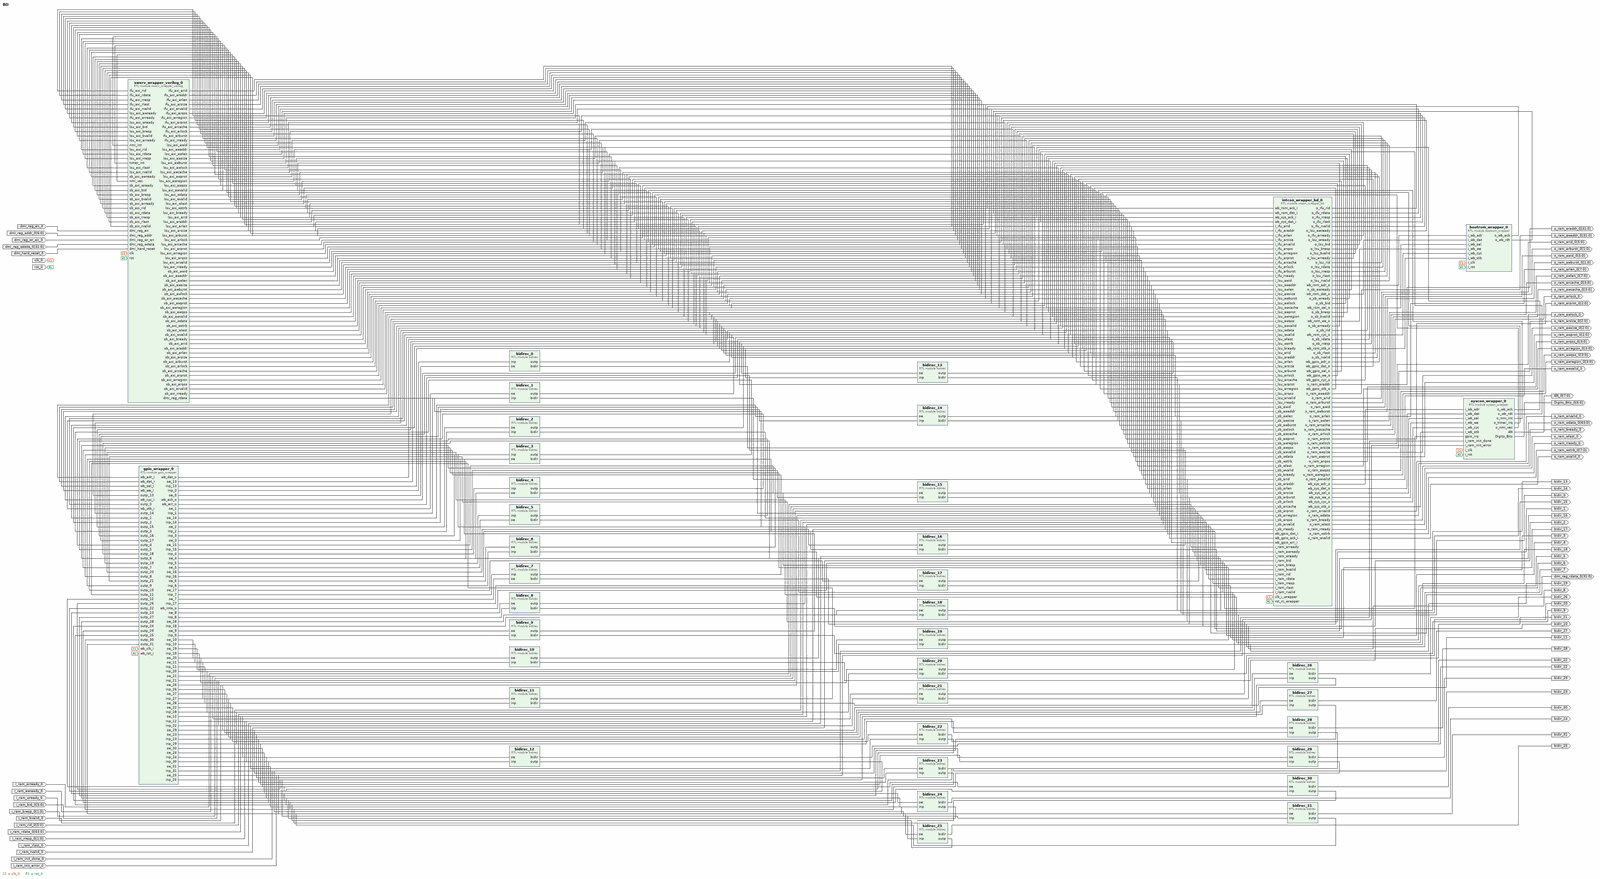
[diagram p0: block diagram of the top level, whole]
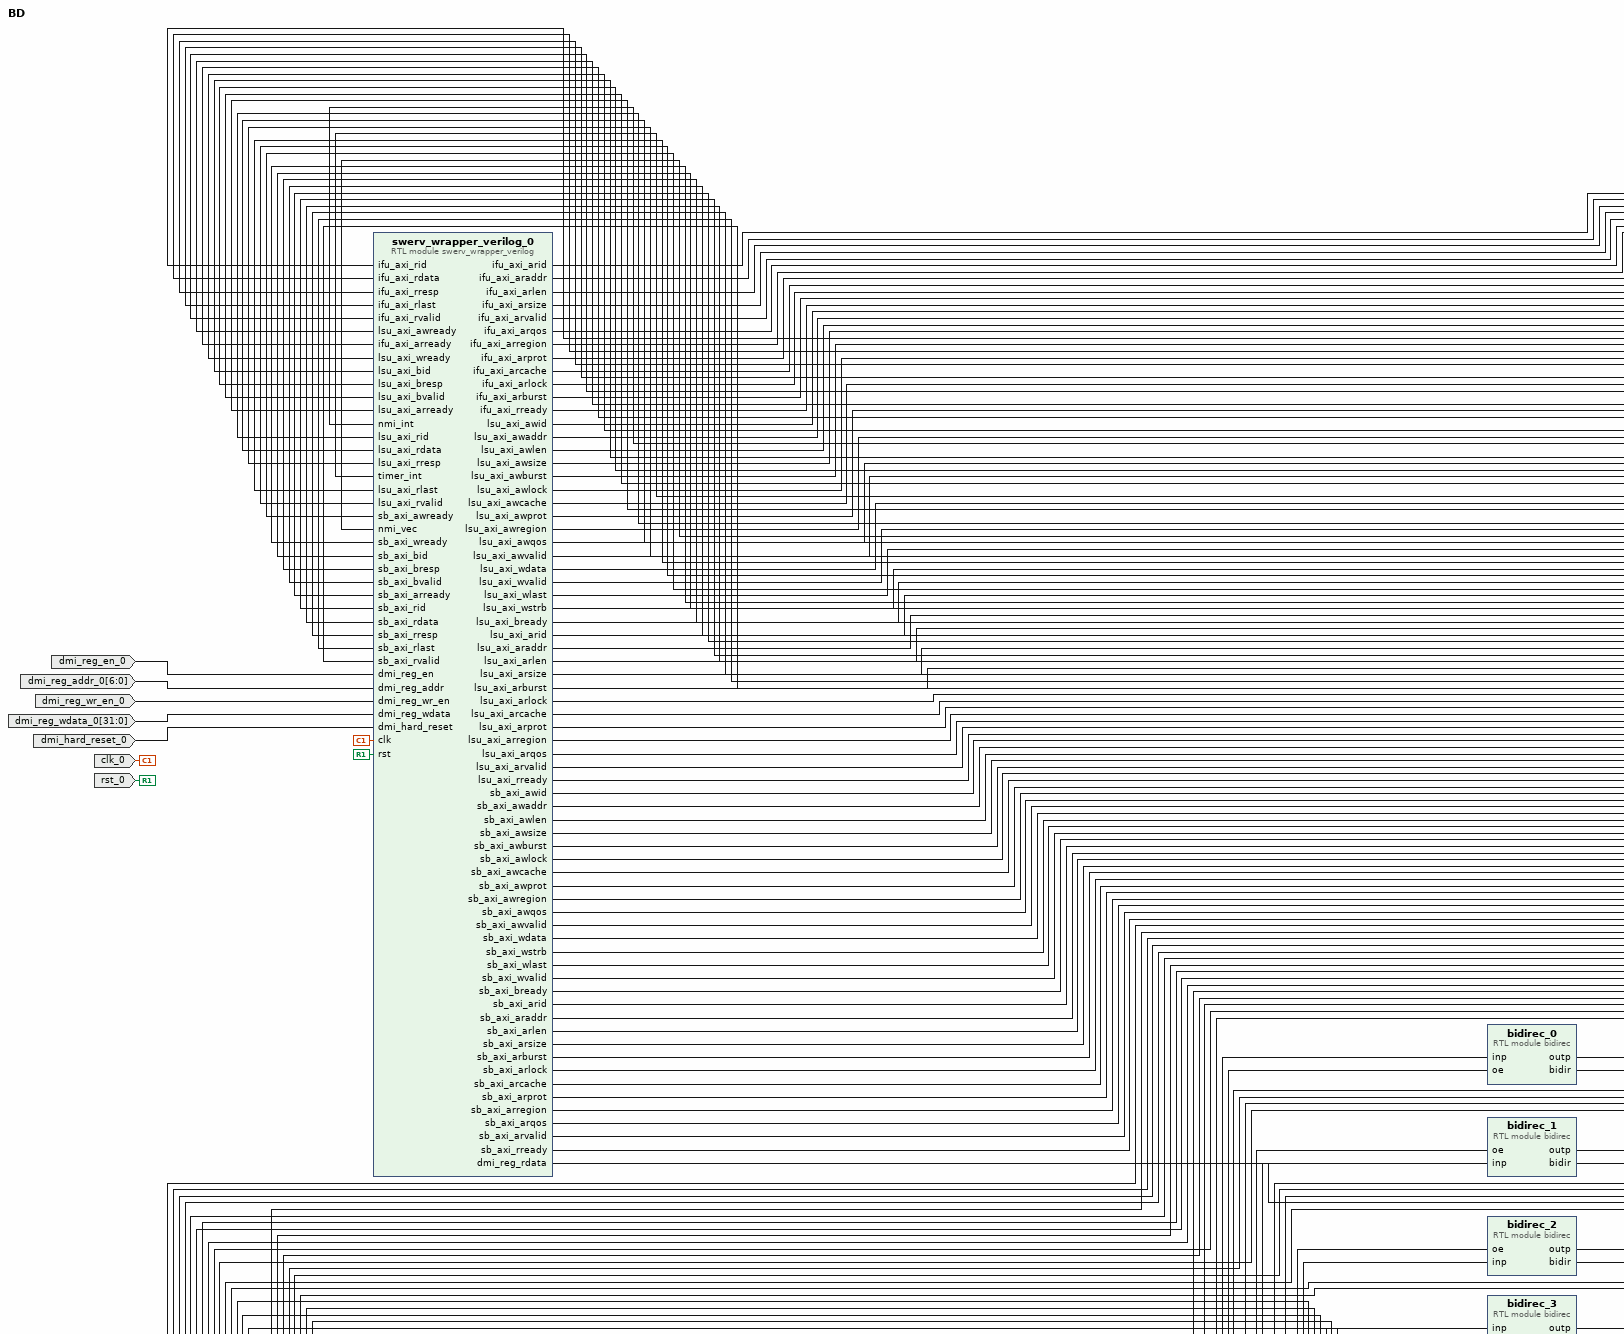
[diagram p1: block diagram of the top level, upper left part]
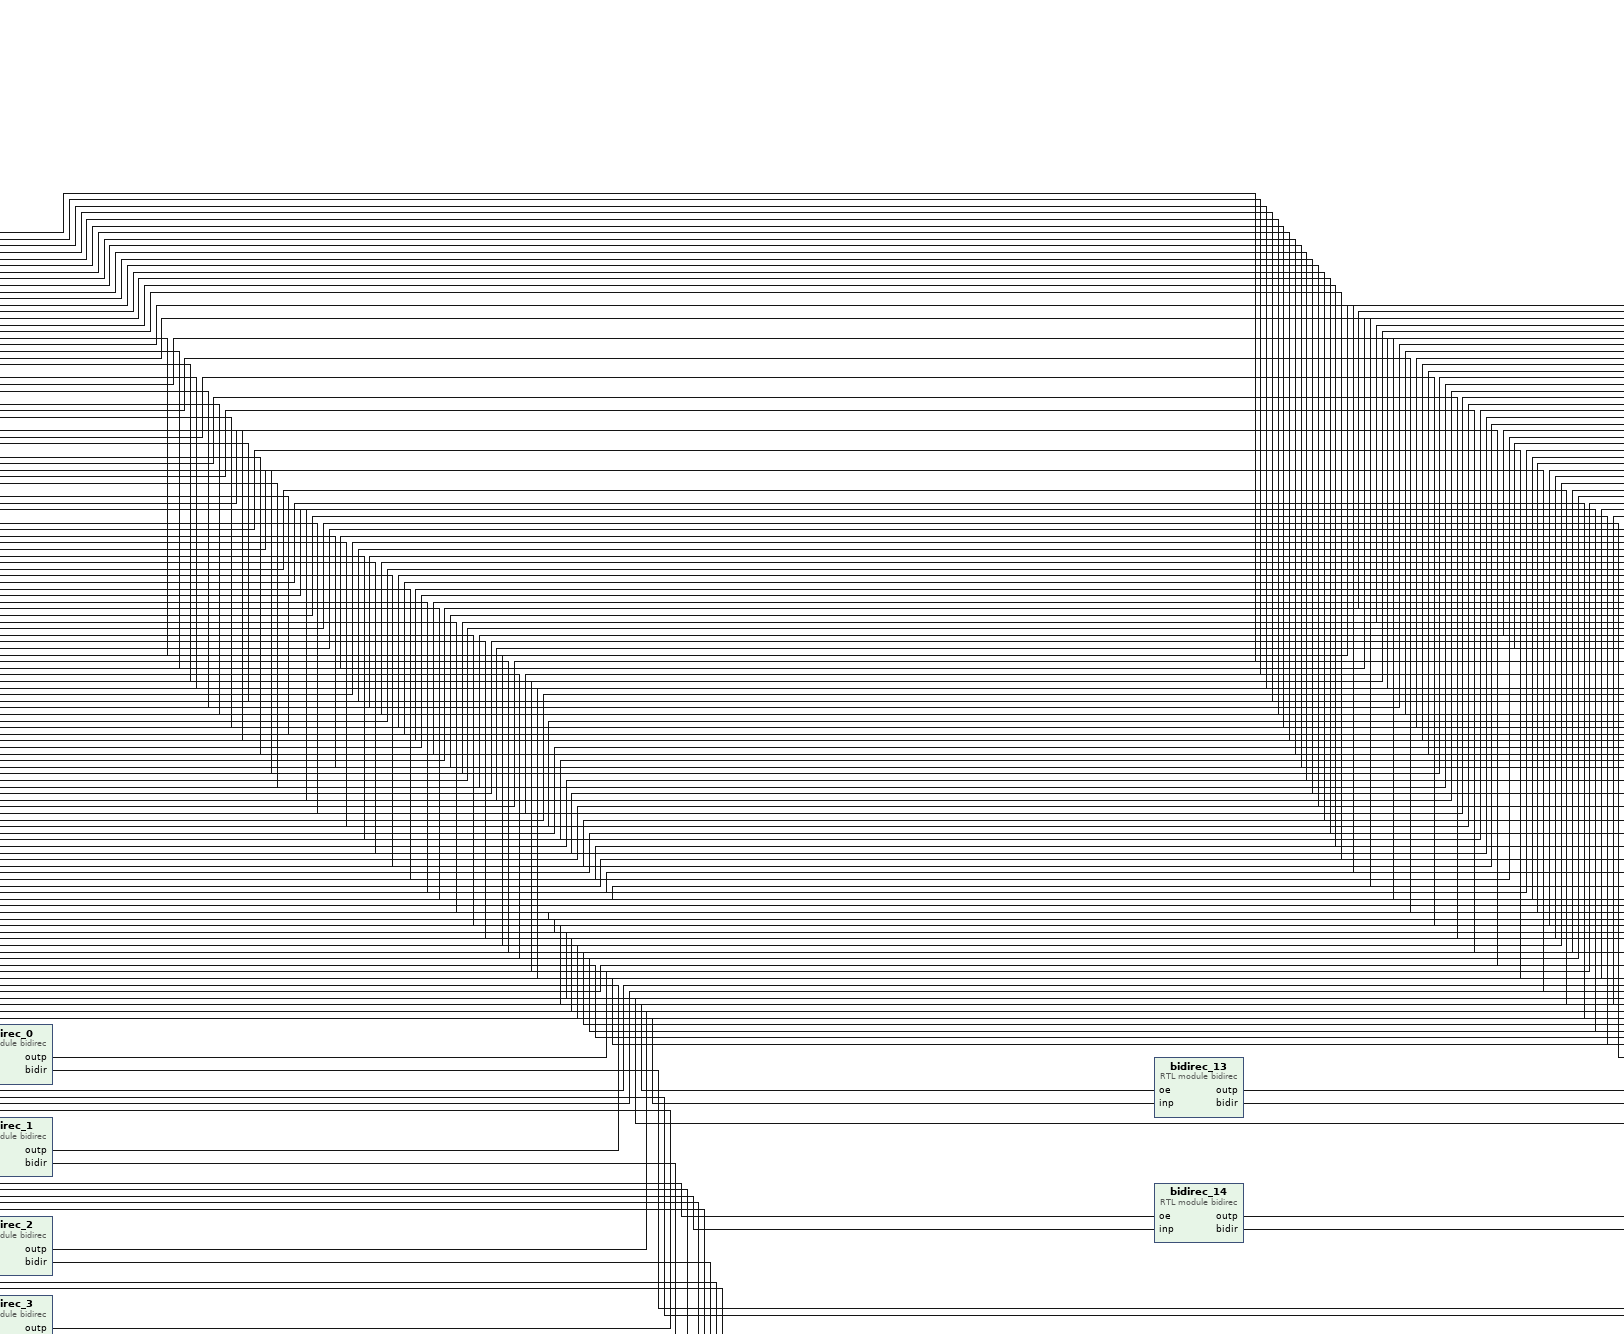
[diagram p2: block diagram of the top level, upper centre part]
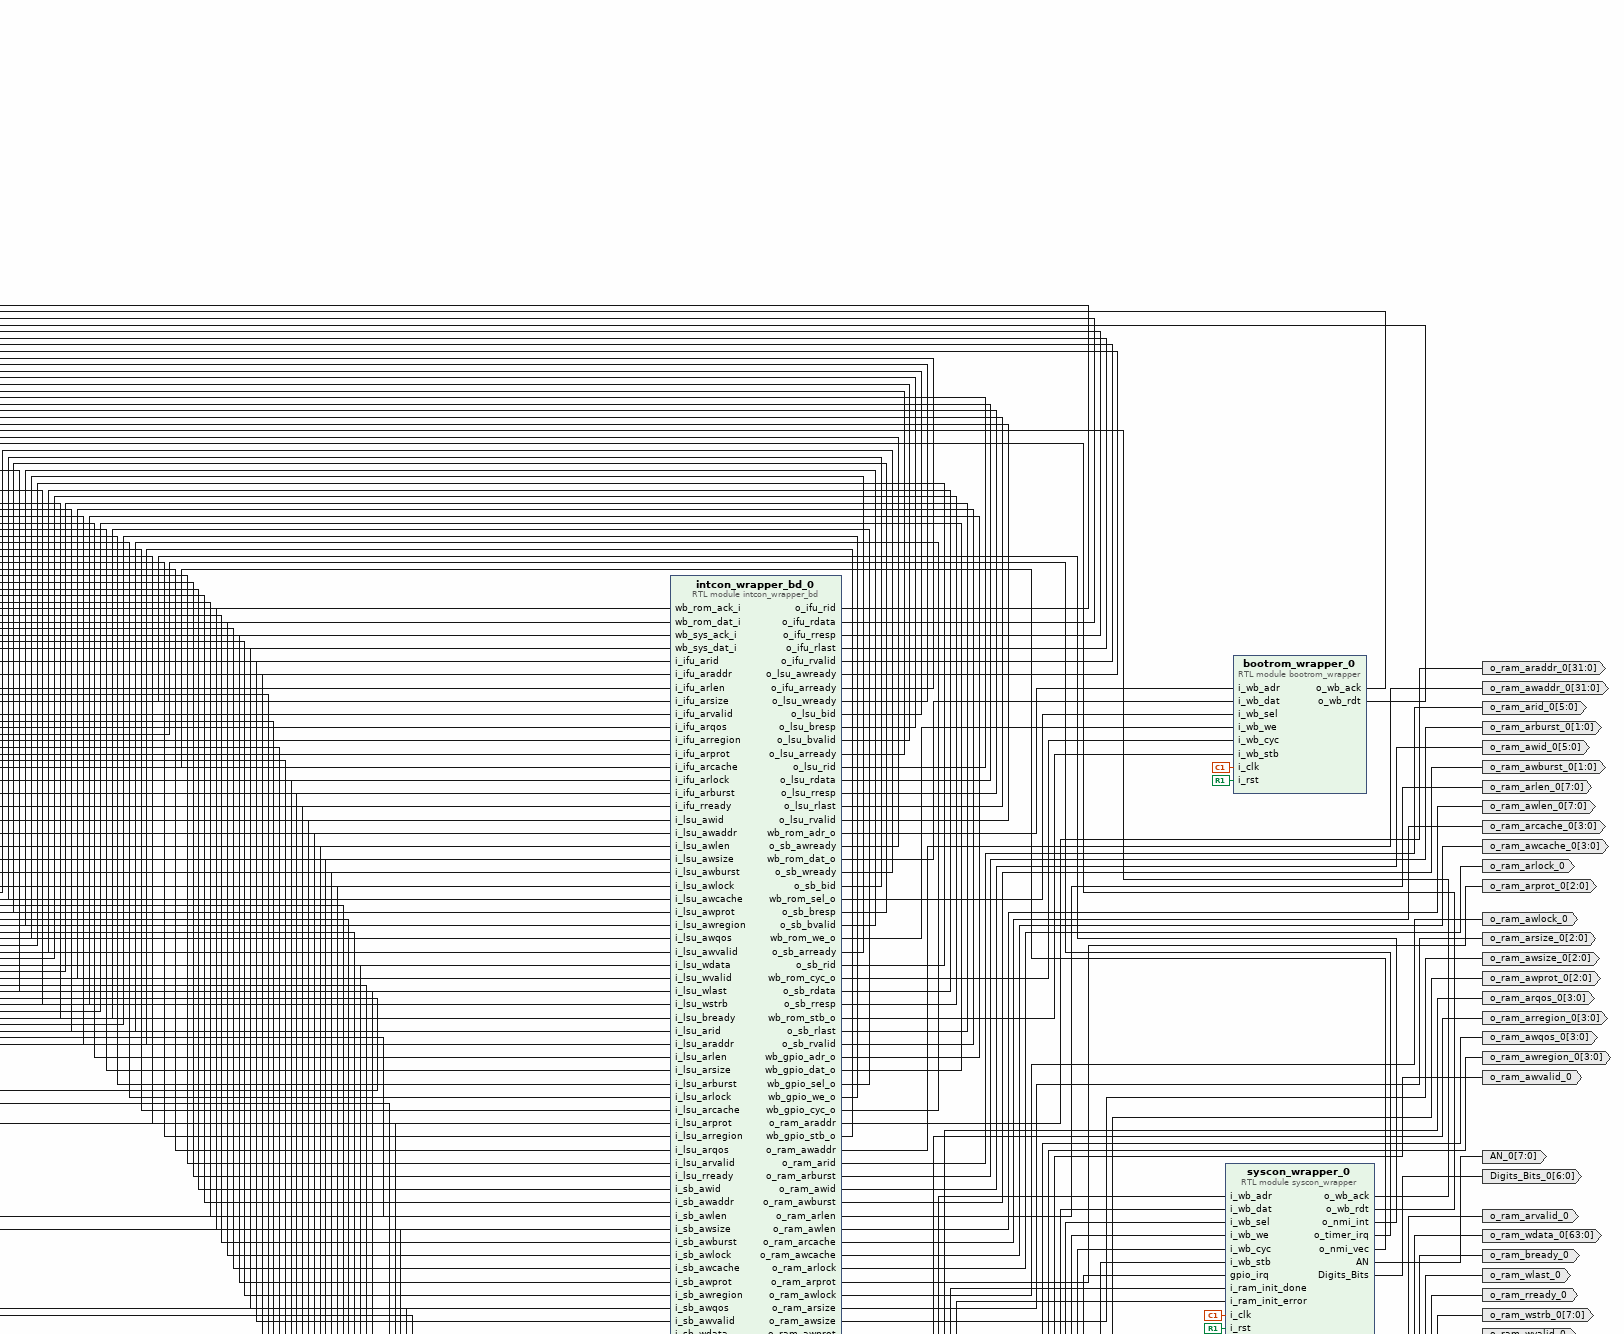
[diagram p3: block diagram of the top level, upper right part]
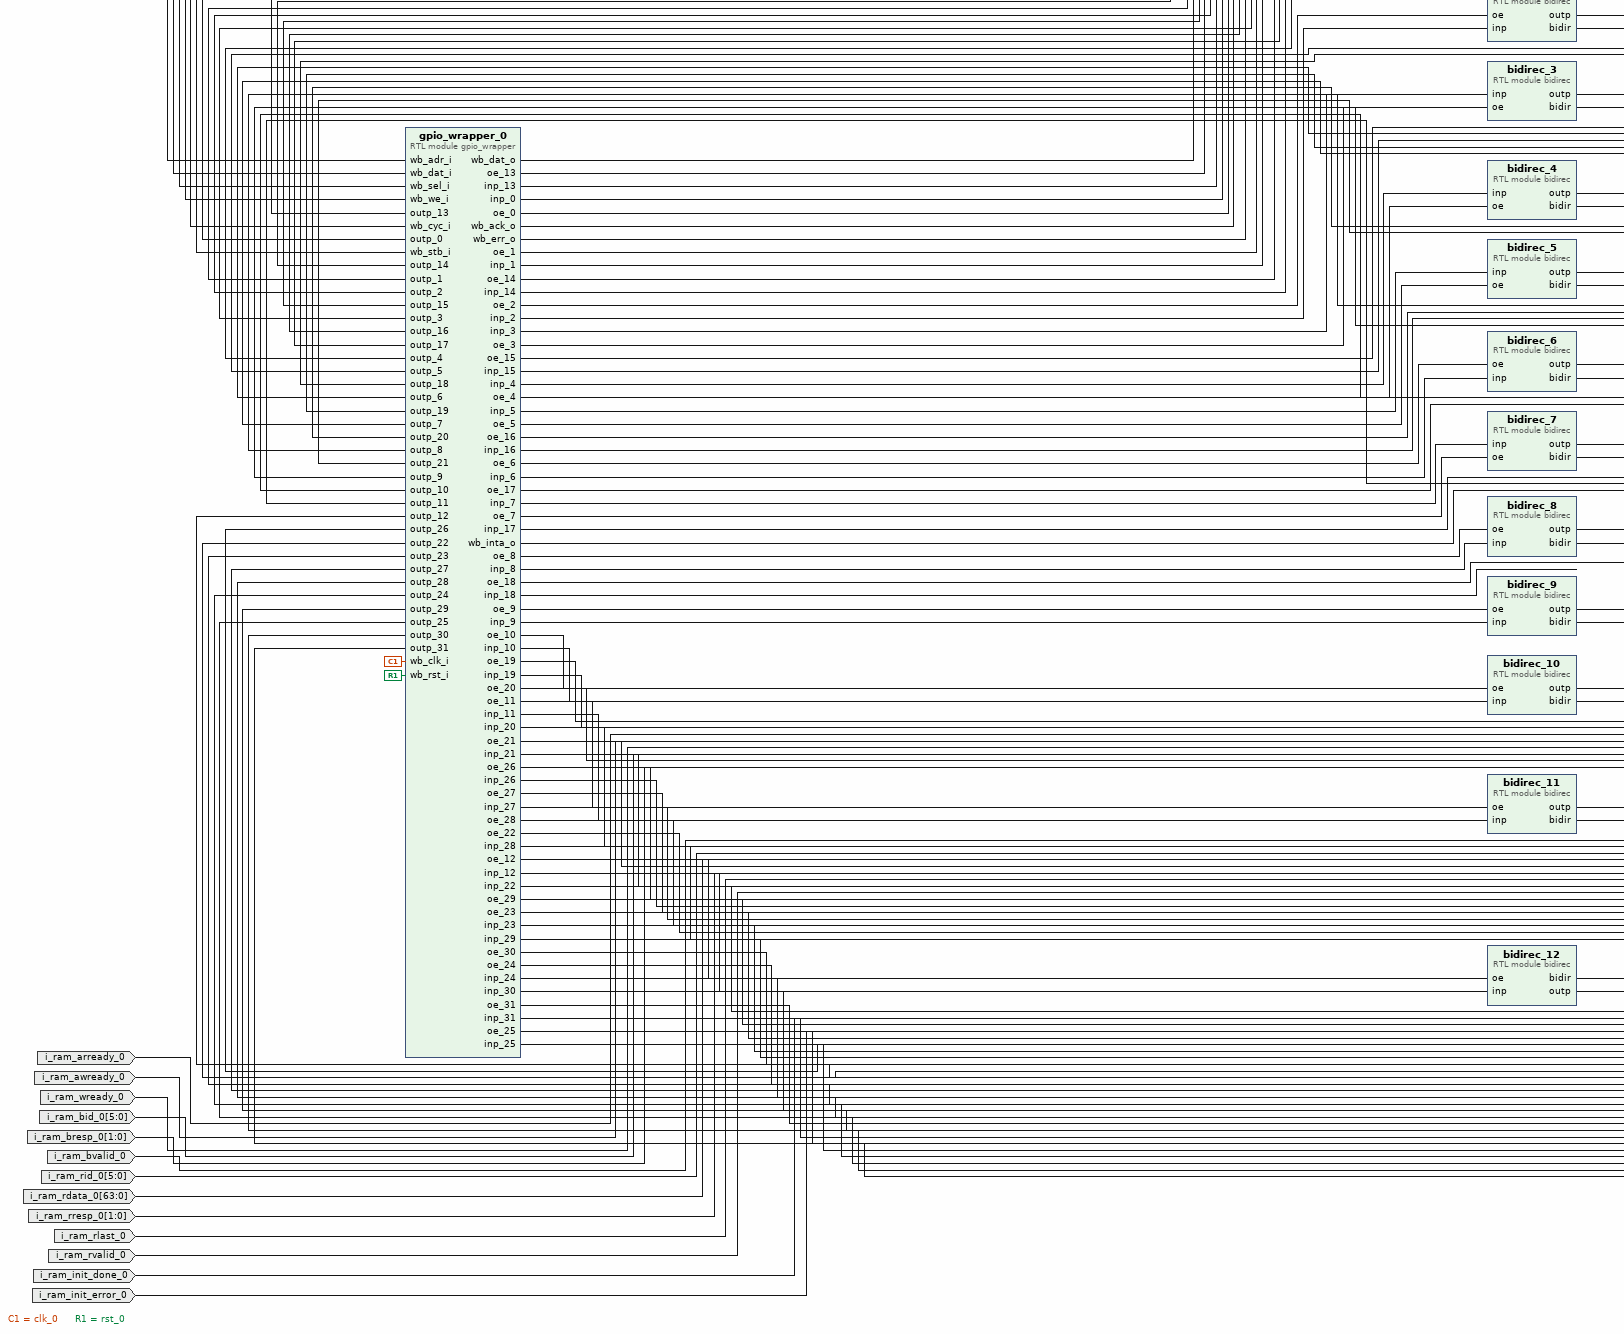
[diagram p4: block diagram of the top level, lower left part]
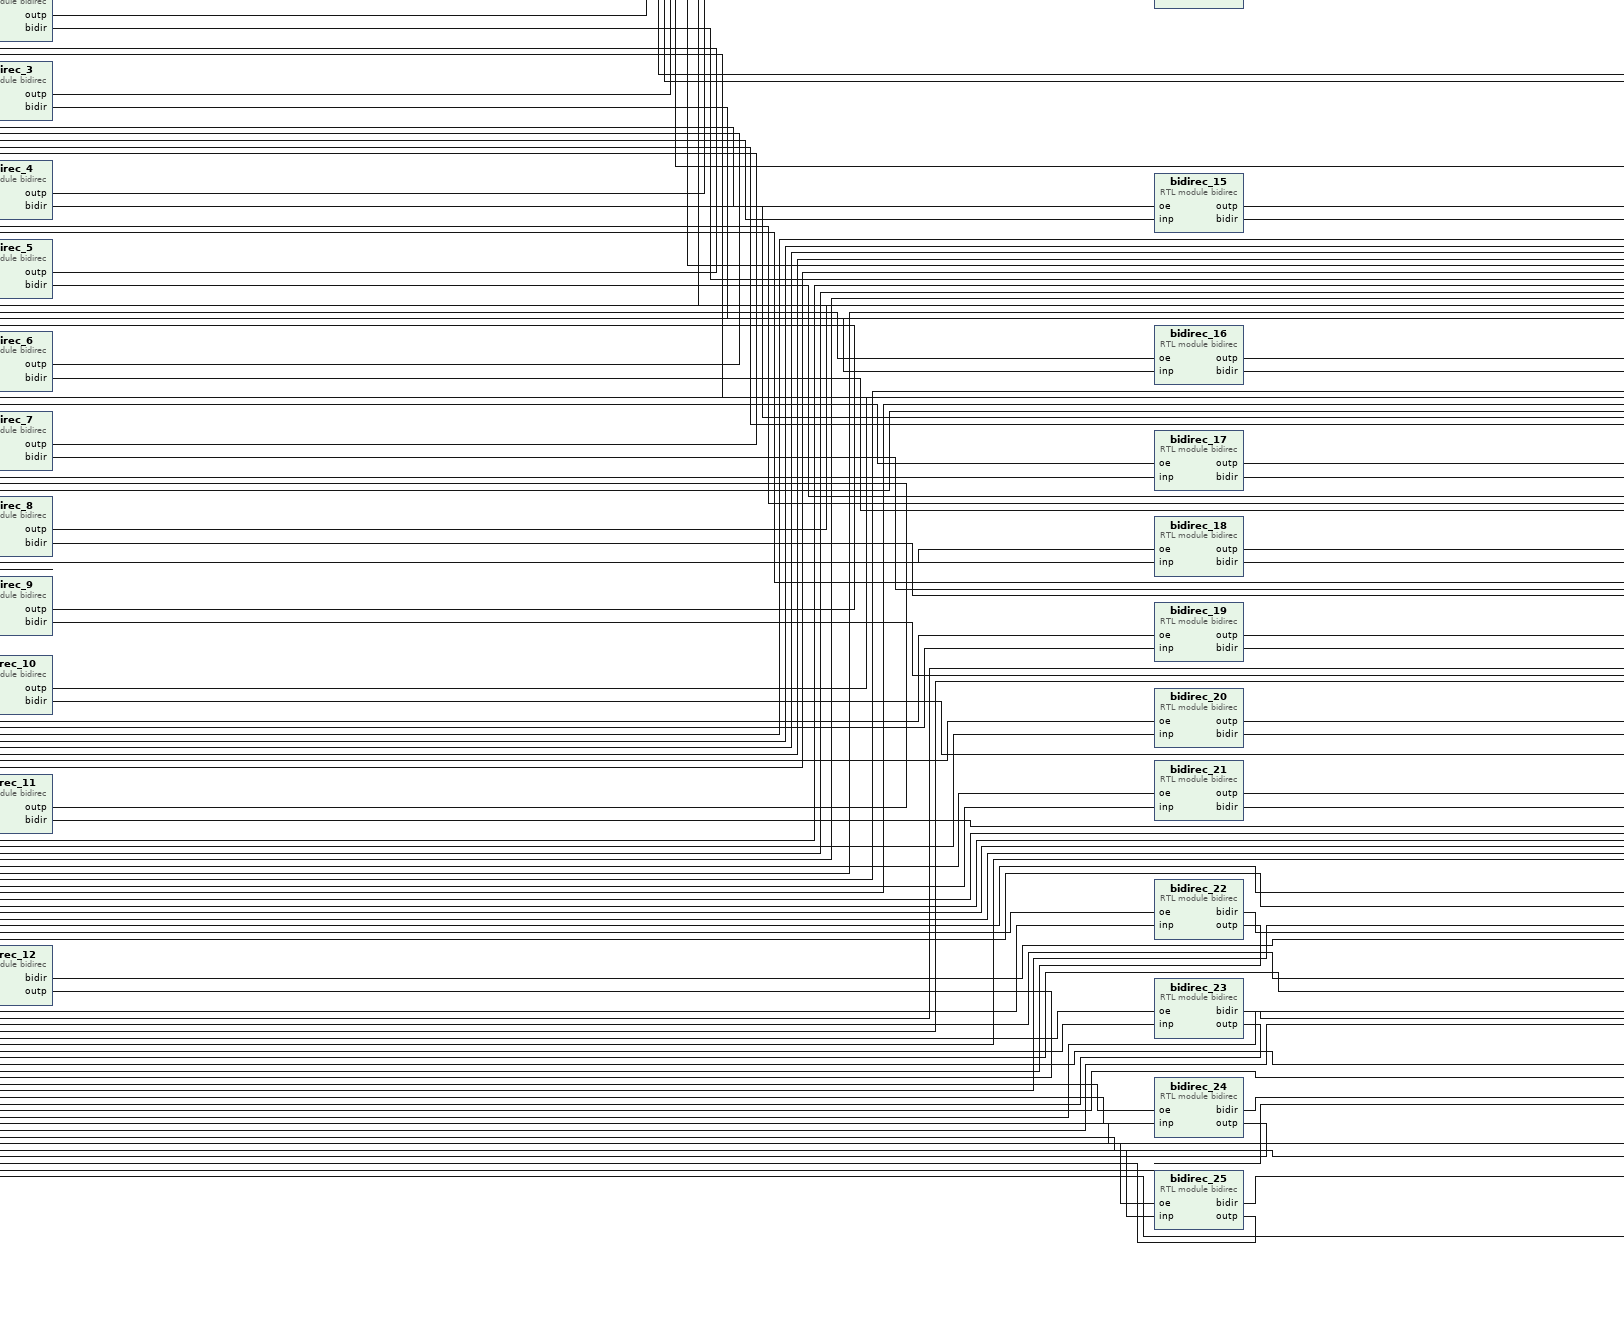
[diagram p5: block diagram of the top level, lower centre part]
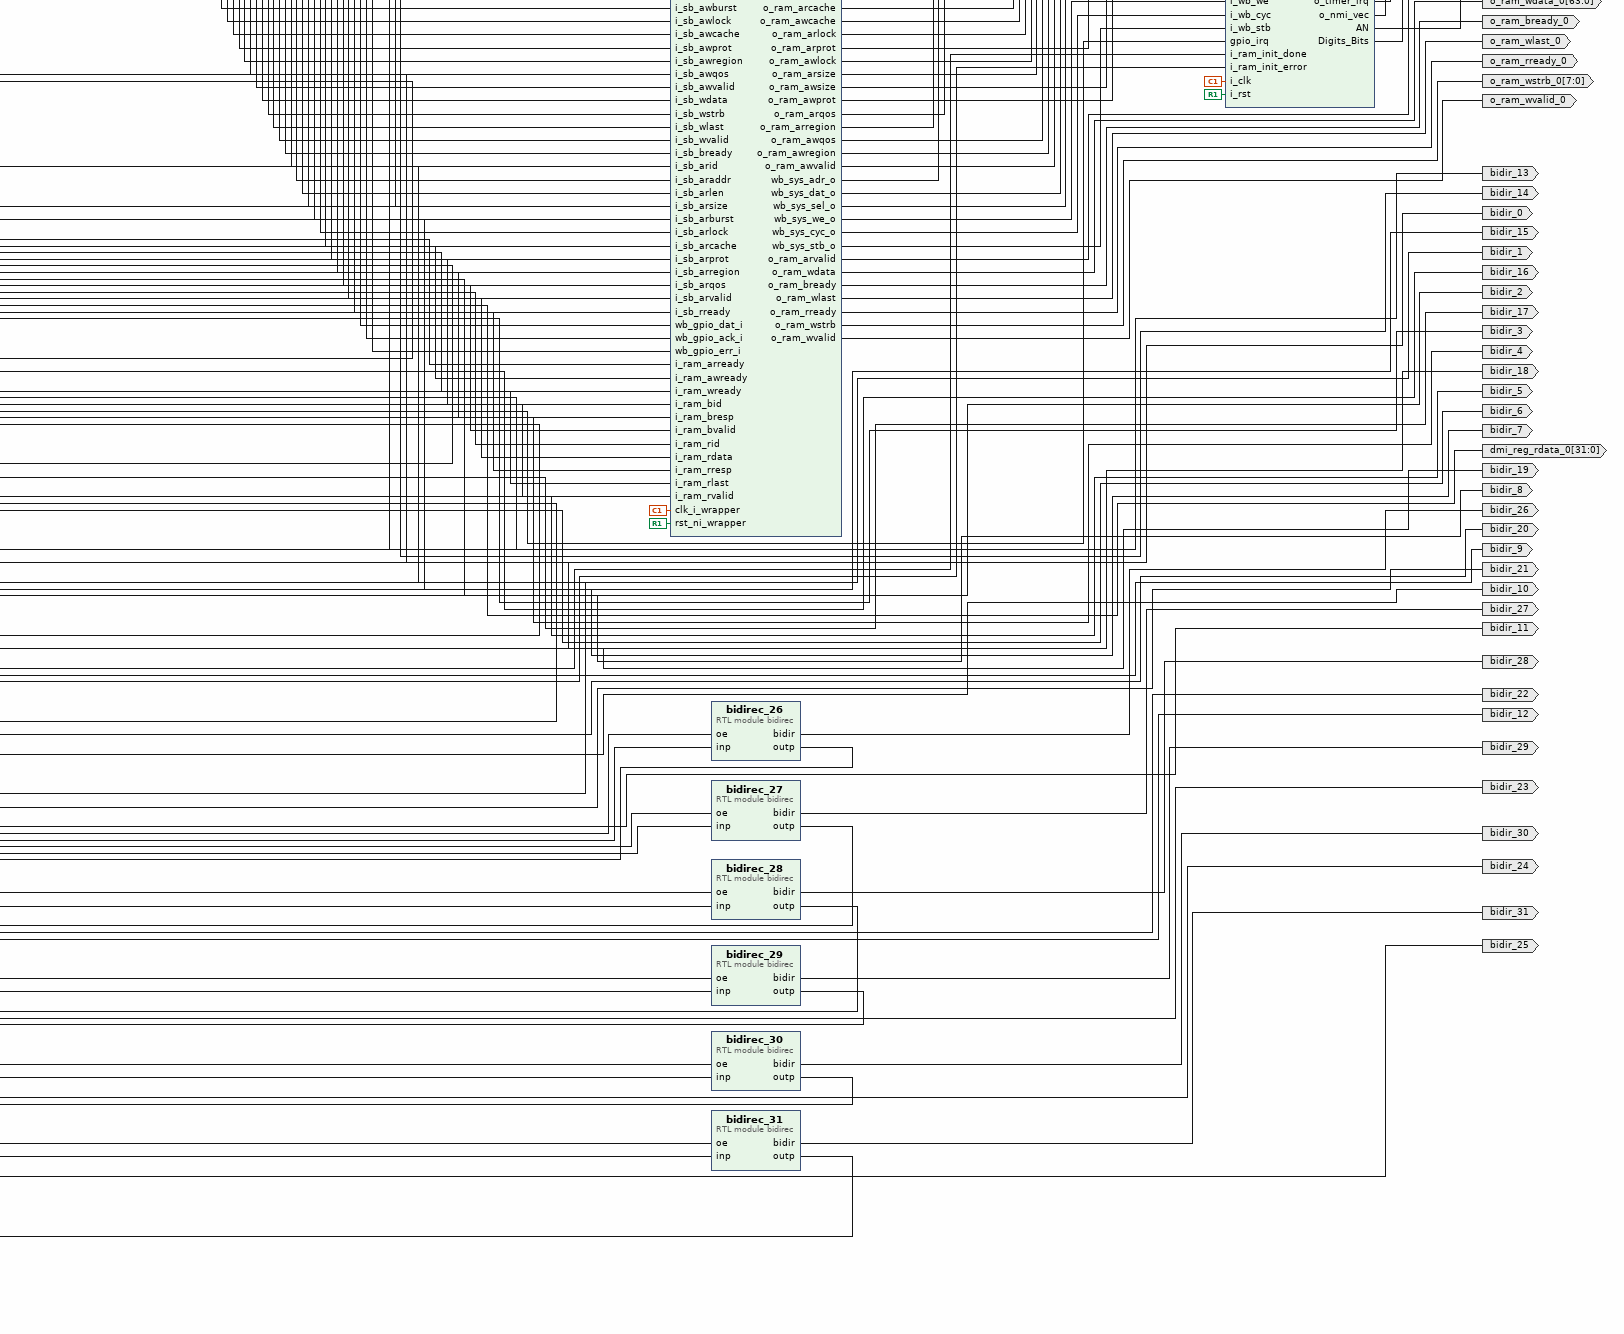
[diagram p6: block diagram of the top level, lower right part]
# Vivado block design BD, xc7a100tcsg324-1, Vivado 2019.2
create_bd_design BD

create_bd_port -dir I -type clk clk_0
create_bd_port -dir I -type rst rst_0
create_bd_port -dir O -from 5 -to 0 o_ram_awid_0
create_bd_port -dir O -from 31 -to 0 o_ram_awaddr_0
create_bd_port -dir O -from 7 -to 0 o_ram_awlen_0
create_bd_port -dir O -from 2 -to 0 o_ram_awsize_0
create_bd_port -dir O -from 1 -to 0 o_ram_awburst_0
create_bd_port -dir O -from 3 -to 0 o_ram_awcache_0
create_bd_port -dir O -from 2 -to 0 o_ram_awprot_0
create_bd_port -dir O o_ram_awlock_0
create_bd_port -dir O -from 3 -to 0 o_ram_awregion_0
create_bd_port -dir O -from 3 -to 0 o_ram_awqos_0
create_bd_port -dir O o_ram_awvalid_0
create_bd_port -dir O -from 5 -to 0 o_ram_arid_0
create_bd_port -dir O -from 31 -to 0 o_ram_araddr_0
create_bd_port -dir O -from 7 -to 0 o_ram_arlen_0
create_bd_port -dir O -from 2 -to 0 o_ram_arsize_0
create_bd_port -dir O -from 1 -to 0 o_ram_arburst_0
create_bd_port -dir O -from 3 -to 0 o_ram_arcache_0
create_bd_port -dir O -from 2 -to 0 o_ram_arprot_0
create_bd_port -dir O o_ram_arlock_0
create_bd_port -dir O -from 3 -to 0 o_ram_arregion_0
create_bd_port -dir O -from 3 -to 0 o_ram_arqos_0
create_bd_port -dir O o_ram_arvalid_0
create_bd_port -dir O -from 63 -to 0 o_ram_wdata_0
create_bd_port -dir O -from 7 -to 0 o_ram_wstrb_0
create_bd_port -dir O o_ram_wlast_0
create_bd_port -dir O o_ram_wvalid_0
create_bd_port -dir O o_ram_bready_0
create_bd_port -dir O o_ram_rready_0
create_bd_port -dir I i_ram_arready_0
create_bd_port -dir I i_ram_awready_0
create_bd_port -dir I i_ram_wready_0
create_bd_port -dir I -from 5 -to 0 i_ram_bid_0
create_bd_port -dir I -from 1 -to 0 i_ram_bresp_0
create_bd_port -dir I i_ram_bvalid_0
create_bd_port -dir I -from 5 -to 0 i_ram_rid_0
create_bd_port -dir I -from 63 -to 0 i_ram_rdata_0
create_bd_port -dir I -from 1 -to 0 i_ram_rresp_0
create_bd_port -dir I i_ram_rlast_0
create_bd_port -dir I i_ram_rvalid_0
create_bd_port -dir I dmi_reg_en_0
create_bd_port -dir I -from 6 -to 0 dmi_reg_addr_0
create_bd_port -dir I dmi_reg_wr_en_0
create_bd_port -dir I -from 31 -to 0 dmi_reg_wdata_0
create_bd_port -dir I -type rst dmi_hard_reset_0
create_bd_port -dir O -from 31 -to 0 dmi_reg_rdata_0
create_bd_port -dir I i_ram_init_done_0
create_bd_port -dir I i_ram_init_error_0
create_bd_port -dir O -from 7 -to 0 AN_0
create_bd_port -dir O -from 6 -to 0 Digits_Bits_0
create_bd_port -dir O bidir_0
create_bd_port -dir O bidir_1
create_bd_port -dir O bidir_2
create_bd_port -dir O bidir_3
create_bd_port -dir O bidir_4
create_bd_port -dir O bidir_5
create_bd_port -dir O bidir_6
create_bd_port -dir O bidir_7
create_bd_port -dir O bidir_8
create_bd_port -dir O bidir_9
create_bd_port -dir O bidir_10
create_bd_port -dir O bidir_11
create_bd_port -dir O bidir_12
create_bd_port -dir O bidir_13
create_bd_port -dir O bidir_14
create_bd_port -dir O bidir_15
create_bd_port -dir O bidir_16
create_bd_port -dir O bidir_17
create_bd_port -dir O bidir_18
create_bd_port -dir O bidir_19
create_bd_port -dir O bidir_20
create_bd_port -dir O bidir_21
create_bd_port -dir O bidir_22
create_bd_port -dir O bidir_23
create_bd_port -dir O bidir_24
create_bd_port -dir O bidir_25
create_bd_port -dir O bidir_26
create_bd_port -dir O bidir_27
create_bd_port -dir O bidir_28
create_bd_port -dir O bidir_29
create_bd_port -dir O bidir_30
create_bd_port -dir O bidir_31

create_bd_cell -type module -reference swerv_wrapper_verilog swerv_wrapper_verilog_0
create_bd_cell -type module -reference intcon_wrapper_bd intcon_wrapper_bd_0
create_bd_cell -type module -reference bootrom_wrapper bootrom_wrapper_0
create_bd_cell -type module -reference gpio_wrapper gpio_wrapper_0
create_bd_cell -type module -reference syscon_wrapper syscon_wrapper_0
create_bd_cell -type module -reference bidirec bidirec_0
create_bd_cell -type module -reference bidirec bidirec_1
create_bd_cell -type module -reference bidirec bidirec_2
create_bd_cell -type module -reference bidirec bidirec_3
create_bd_cell -type module -reference bidirec bidirec_4
create_bd_cell -type module -reference bidirec bidirec_5
create_bd_cell -type module -reference bidirec bidirec_6
create_bd_cell -type module -reference bidirec bidirec_7
create_bd_cell -type module -reference bidirec bidirec_8
create_bd_cell -type module -reference bidirec bidirec_9
create_bd_cell -type module -reference bidirec bidirec_10
create_bd_cell -type module -reference bidirec bidirec_11
create_bd_cell -type module -reference bidirec bidirec_12
create_bd_cell -type module -reference bidirec bidirec_13
create_bd_cell -type module -reference bidirec bidirec_14
create_bd_cell -type module -reference bidirec bidirec_15
create_bd_cell -type module -reference bidirec bidirec_16
create_bd_cell -type module -reference bidirec bidirec_17
create_bd_cell -type module -reference bidirec bidirec_18
create_bd_cell -type module -reference bidirec bidirec_19
create_bd_cell -type module -reference bidirec bidirec_20
create_bd_cell -type module -reference bidirec bidirec_21
create_bd_cell -type module -reference bidirec bidirec_22
create_bd_cell -type module -reference bidirec bidirec_23
create_bd_cell -type module -reference bidirec bidirec_24
create_bd_cell -type module -reference bidirec bidirec_25
create_bd_cell -type module -reference bidirec bidirec_26
create_bd_cell -type module -reference bidirec bidirec_27
create_bd_cell -type module -reference bidirec bidirec_28
create_bd_cell -type module -reference bidirec bidirec_29
create_bd_cell -type module -reference bidirec bidirec_30
create_bd_cell -type module -reference bidirec bidirec_31

# ---- connections ----

connect_bd_net [get_bd_pins swerv_wrapper_verilog_0/ifu_axi_arid] [get_bd_pins intcon_wrapper_bd_0/i_ifu_arid]
connect_bd_net [get_bd_pins swerv_wrapper_verilog_0/ifu_axi_araddr] [get_bd_pins intcon_wrapper_bd_0/i_ifu_araddr]
connect_bd_net [get_bd_pins swerv_wrapper_verilog_0/ifu_axi_arlen] [get_bd_pins intcon_wrapper_bd_0/i_ifu_arlen]
connect_bd_net [get_bd_pins swerv_wrapper_verilog_0/ifu_axi_arsize] [get_bd_pins intcon_wrapper_bd_0/i_ifu_arsize]
connect_bd_net [get_bd_pins swerv_wrapper_verilog_0/ifu_axi_arvalid] [get_bd_pins intcon_wrapper_bd_0/i_ifu_arvalid]
connect_bd_net [get_bd_pins swerv_wrapper_verilog_0/ifu_axi_arqos] [get_bd_pins intcon_wrapper_bd_0/i_ifu_arqos]
connect_bd_net [get_bd_pins swerv_wrapper_verilog_0/ifu_axi_arregion] [get_bd_pins intcon_wrapper_bd_0/i_ifu_arregion]
connect_bd_net [get_bd_pins swerv_wrapper_verilog_0/ifu_axi_arprot] [get_bd_pins intcon_wrapper_bd_0/i_ifu_arprot]
connect_bd_net [get_bd_pins swerv_wrapper_verilog_0/ifu_axi_arcache] [get_bd_pins intcon_wrapper_bd_0/i_ifu_arcache]
connect_bd_net [get_bd_pins swerv_wrapper_verilog_0/ifu_axi_arlock] [get_bd_pins intcon_wrapper_bd_0/i_ifu_arlock]
connect_bd_net [get_bd_pins swerv_wrapper_verilog_0/ifu_axi_arburst] [get_bd_pins intcon_wrapper_bd_0/i_ifu_arburst]
connect_bd_net [get_bd_pins intcon_wrapper_bd_0/o_ifu_rid] [get_bd_pins swerv_wrapper_verilog_0/ifu_axi_rid]
connect_bd_net [get_bd_pins intcon_wrapper_bd_0/o_ifu_rdata] [get_bd_pins swerv_wrapper_verilog_0/ifu_axi_rdata]
connect_bd_net [get_bd_pins intcon_wrapper_bd_0/o_ifu_rresp] [get_bd_pins swerv_wrapper_verilog_0/ifu_axi_rresp]
connect_bd_net [get_bd_pins intcon_wrapper_bd_0/o_ifu_rlast] [get_bd_pins swerv_wrapper_verilog_0/ifu_axi_rlast]
connect_bd_net [get_bd_pins intcon_wrapper_bd_0/o_ifu_rvalid] [get_bd_pins swerv_wrapper_verilog_0/ifu_axi_rvalid]
connect_bd_net [get_bd_pins swerv_wrapper_verilog_0/ifu_axi_rready] [get_bd_pins intcon_wrapper_bd_0/i_ifu_rready]
connect_bd_net [get_bd_pins swerv_wrapper_verilog_0/lsu_axi_awid] [get_bd_pins intcon_wrapper_bd_0/i_lsu_awid]
connect_bd_net [get_bd_pins swerv_wrapper_verilog_0/lsu_axi_awaddr] [get_bd_pins intcon_wrapper_bd_0/i_lsu_awaddr]
connect_bd_net [get_bd_pins swerv_wrapper_verilog_0/lsu_axi_awlen] [get_bd_pins intcon_wrapper_bd_0/i_lsu_awlen]
connect_bd_net [get_bd_pins swerv_wrapper_verilog_0/lsu_axi_awsize] [get_bd_pins intcon_wrapper_bd_0/i_lsu_awsize]
connect_bd_net [get_bd_pins swerv_wrapper_verilog_0/lsu_axi_awburst] [get_bd_pins intcon_wrapper_bd_0/i_lsu_awburst]
connect_bd_net [get_bd_pins swerv_wrapper_verilog_0/lsu_axi_awlock] [get_bd_pins intcon_wrapper_bd_0/i_lsu_awlock]
connect_bd_net [get_bd_pins swerv_wrapper_verilog_0/lsu_axi_awcache] [get_bd_pins intcon_wrapper_bd_0/i_lsu_awcache]
connect_bd_net [get_bd_pins swerv_wrapper_verilog_0/lsu_axi_awprot] [get_bd_pins intcon_wrapper_bd_0/i_lsu_awprot]
connect_bd_net [get_bd_pins swerv_wrapper_verilog_0/lsu_axi_awregion] [get_bd_pins intcon_wrapper_bd_0/i_lsu_awregion]
connect_bd_net [get_bd_pins swerv_wrapper_verilog_0/lsu_axi_awqos] [get_bd_pins intcon_wrapper_bd_0/i_lsu_awqos]
connect_bd_net [get_bd_pins swerv_wrapper_verilog_0/lsu_axi_awvalid] [get_bd_pins intcon_wrapper_bd_0/i_lsu_awvalid]
connect_bd_net [get_bd_pins intcon_wrapper_bd_0/o_lsu_awready] [get_bd_pins swerv_wrapper_verilog_0/lsu_axi_awready]
connect_bd_net [get_bd_pins swerv_wrapper_verilog_0/lsu_axi_wdata] [get_bd_pins intcon_wrapper_bd_0/i_lsu_wdata]
connect_bd_net [get_bd_pins swerv_wrapper_verilog_0/lsu_axi_wvalid] [get_bd_pins intcon_wrapper_bd_0/i_lsu_wvalid]
connect_bd_net [get_bd_pins swerv_wrapper_verilog_0/lsu_axi_wlast] [get_bd_pins intcon_wrapper_bd_0/i_lsu_wlast]
connect_bd_net [get_bd_pins intcon_wrapper_bd_0/o_ifu_arready] [get_bd_pins swerv_wrapper_verilog_0/ifu_axi_arready]
connect_bd_net [get_bd_pins swerv_wrapper_verilog_0/lsu_axi_wstrb] [get_bd_pins intcon_wrapper_bd_0/i_lsu_wstrb]
connect_bd_net [get_bd_pins intcon_wrapper_bd_0/o_lsu_wready] [get_bd_pins swerv_wrapper_verilog_0/lsu_axi_wready]
connect_bd_net [get_bd_pins intcon_wrapper_bd_0/o_lsu_bid] [get_bd_pins swerv_wrapper_verilog_0/lsu_axi_bid]
connect_bd_net [get_bd_pins intcon_wrapper_bd_0/o_lsu_bresp] [get_bd_pins swerv_wrapper_verilog_0/lsu_axi_bresp]
connect_bd_net [get_bd_pins intcon_wrapper_bd_0/o_lsu_bvalid] [get_bd_pins swerv_wrapper_verilog_0/lsu_axi_bvalid]
connect_bd_net [get_bd_pins swerv_wrapper_verilog_0/lsu_axi_bready] [get_bd_pins intcon_wrapper_bd_0/i_lsu_bready]
connect_bd_net [get_bd_pins swerv_wrapper_verilog_0/lsu_axi_arid] [get_bd_pins intcon_wrapper_bd_0/i_lsu_arid]
connect_bd_net [get_bd_pins swerv_wrapper_verilog_0/lsu_axi_araddr] [get_bd_pins intcon_wrapper_bd_0/i_lsu_araddr]
connect_bd_net [get_bd_pins swerv_wrapper_verilog_0/lsu_axi_arlen] [get_bd_pins intcon_wrapper_bd_0/i_lsu_arlen]
connect_bd_net [get_bd_pins swerv_wrapper_verilog_0/lsu_axi_arsize] [get_bd_pins intcon_wrapper_bd_0/i_lsu_arsize]
connect_bd_net [get_bd_pins swerv_wrapper_verilog_0/lsu_axi_arburst] [get_bd_pins intcon_wrapper_bd_0/i_lsu_arburst]
connect_bd_net [get_bd_pins swerv_wrapper_verilog_0/lsu_axi_arlock] [get_bd_pins intcon_wrapper_bd_0/i_lsu_arlock]
connect_bd_net [get_bd_pins swerv_wrapper_verilog_0/lsu_axi_arcache] [get_bd_pins intcon_wrapper_bd_0/i_lsu_arcache]
connect_bd_net [get_bd_pins swerv_wrapper_verilog_0/lsu_axi_arprot] [get_bd_pins intcon_wrapper_bd_0/i_lsu_arprot]
connect_bd_net [get_bd_pins swerv_wrapper_verilog_0/lsu_axi_arregion] [get_bd_pins intcon_wrapper_bd_0/i_lsu_arregion]
connect_bd_net [get_bd_pins swerv_wrapper_verilog_0/lsu_axi_arqos] [get_bd_pins intcon_wrapper_bd_0/i_lsu_arqos]
connect_bd_net [get_bd_pins swerv_wrapper_verilog_0/lsu_axi_arvalid] [get_bd_pins intcon_wrapper_bd_0/i_lsu_arvalid]
connect_bd_net [get_bd_pins intcon_wrapper_bd_0/o_lsu_arready] [get_bd_pins swerv_wrapper_verilog_0/lsu_axi_arready]
connect_bd_net [get_bd_pins intcon_wrapper_bd_0/o_lsu_rid] [get_bd_pins swerv_wrapper_verilog_0/lsu_axi_rid]
connect_bd_net [get_bd_pins intcon_wrapper_bd_0/o_lsu_rdata] [get_bd_pins swerv_wrapper_verilog_0/lsu_axi_rdata]
connect_bd_net [get_bd_pins intcon_wrapper_bd_0/o_lsu_rresp] [get_bd_pins swerv_wrapper_verilog_0/lsu_axi_rresp]
connect_bd_net [get_bd_pins intcon_wrapper_bd_0/o_lsu_rlast] [get_bd_pins swerv_wrapper_verilog_0/lsu_axi_rlast]
connect_bd_net [get_bd_pins intcon_wrapper_bd_0/o_lsu_rvalid] [get_bd_pins swerv_wrapper_verilog_0/lsu_axi_rvalid]
connect_bd_net [get_bd_pins swerv_wrapper_verilog_0/lsu_axi_rready] [get_bd_pins intcon_wrapper_bd_0/i_lsu_rready]
connect_bd_net [get_bd_pins swerv_wrapper_verilog_0/sb_axi_awid] [get_bd_pins intcon_wrapper_bd_0/i_sb_awid]
connect_bd_net [get_bd_pins swerv_wrapper_verilog_0/sb_axi_awaddr] [get_bd_pins intcon_wrapper_bd_0/i_sb_awaddr]
connect_bd_net [get_bd_pins swerv_wrapper_verilog_0/sb_axi_awlen] [get_bd_pins intcon_wrapper_bd_0/i_sb_awlen]
connect_bd_net [get_bd_pins swerv_wrapper_verilog_0/sb_axi_awsize] [get_bd_pins intcon_wrapper_bd_0/i_sb_awsize]
connect_bd_net [get_bd_pins swerv_wrapper_verilog_0/sb_axi_awburst] [get_bd_pins intcon_wrapper_bd_0/i_sb_awburst]
connect_bd_net [get_bd_pins swerv_wrapper_verilog_0/sb_axi_awlock] [get_bd_pins intcon_wrapper_bd_0/i_sb_awlock]
connect_bd_net [get_bd_pins swerv_wrapper_verilog_0/sb_axi_awcache] [get_bd_pins intcon_wrapper_bd_0/i_sb_awcache]
connect_bd_net [get_bd_pins swerv_wrapper_verilog_0/sb_axi_awprot] [get_bd_pins intcon_wrapper_bd_0/i_sb_awprot]
connect_bd_net [get_bd_pins swerv_wrapper_verilog_0/sb_axi_awregion] [get_bd_pins intcon_wrapper_bd_0/i_sb_awregion]
connect_bd_net [get_bd_pins swerv_wrapper_verilog_0/sb_axi_awqos] [get_bd_pins intcon_wrapper_bd_0/i_sb_awqos]
connect_bd_net [get_bd_pins swerv_wrapper_verilog_0/sb_axi_awvalid] [get_bd_pins intcon_wrapper_bd_0/i_sb_awvalid]
connect_bd_net [get_bd_pins intcon_wrapper_bd_0/o_sb_awready] [get_bd_pins swerv_wrapper_verilog_0/sb_axi_awready]
connect_bd_net [get_bd_pins swerv_wrapper_verilog_0/sb_axi_wdata] [get_bd_pins intcon_wrapper_bd_0/i_sb_wdata]
connect_bd_net [get_bd_pins swerv_wrapper_verilog_0/sb_axi_wstrb] [get_bd_pins intcon_wrapper_bd_0/i_sb_wstrb]
connect_bd_net [get_bd_pins swerv_wrapper_verilog_0/sb_axi_wlast] [get_bd_pins intcon_wrapper_bd_0/i_sb_wlast]
connect_bd_net [get_bd_pins swerv_wrapper_verilog_0/sb_axi_wvalid] [get_bd_pins intcon_wrapper_bd_0/i_sb_wvalid]
connect_bd_net [get_bd_pins intcon_wrapper_bd_0/o_sb_wready] [get_bd_pins swerv_wrapper_verilog_0/sb_axi_wready]
connect_bd_net [get_bd_pins intcon_wrapper_bd_0/o_sb_bid] [get_bd_pins swerv_wrapper_verilog_0/sb_axi_bid]
connect_bd_net [get_bd_pins intcon_wrapper_bd_0/o_sb_bresp] [get_bd_pins swerv_wrapper_verilog_0/sb_axi_bresp]
connect_bd_net [get_bd_pins intcon_wrapper_bd_0/o_sb_bvalid] [get_bd_pins swerv_wrapper_verilog_0/sb_axi_bvalid]
connect_bd_net [get_bd_pins swerv_wrapper_verilog_0/sb_axi_bready] [get_bd_pins intcon_wrapper_bd_0/i_sb_bready]
connect_bd_net [get_bd_pins swerv_wrapper_verilog_0/sb_axi_arid] [get_bd_pins intcon_wrapper_bd_0/i_sb_arid]
connect_bd_net [get_bd_pins swerv_wrapper_verilog_0/sb_axi_araddr] [get_bd_pins intcon_wrapper_bd_0/i_sb_araddr]
connect_bd_net [get_bd_pins swerv_wrapper_verilog_0/sb_axi_arlen] [get_bd_pins intcon_wrapper_bd_0/i_sb_arlen]
connect_bd_net [get_bd_pins swerv_wrapper_verilog_0/sb_axi_arsize] [get_bd_pins intcon_wrapper_bd_0/i_sb_arsize]
connect_bd_net [get_bd_pins swerv_wrapper_verilog_0/sb_axi_arburst] [get_bd_pins intcon_wrapper_bd_0/i_sb_arburst]
connect_bd_net [get_bd_pins swerv_wrapper_verilog_0/sb_axi_arlock] [get_bd_pins intcon_wrapper_bd_0/i_sb_arlock]
connect_bd_net [get_bd_pins swerv_wrapper_verilog_0/sb_axi_arcache] [get_bd_pins intcon_wrapper_bd_0/i_sb_arcache]
connect_bd_net [get_bd_pins swerv_wrapper_verilog_0/sb_axi_arprot] [get_bd_pins intcon_wrapper_bd_0/i_sb_arprot]
connect_bd_net [get_bd_pins swerv_wrapper_verilog_0/sb_axi_arregion] [get_bd_pins intcon_wrapper_bd_0/i_sb_arregion]
connect_bd_net [get_bd_pins swerv_wrapper_verilog_0/sb_axi_arqos] [get_bd_pins intcon_wrapper_bd_0/i_sb_arqos]
connect_bd_net [get_bd_pins swerv_wrapper_verilog_0/sb_axi_arvalid] [get_bd_pins intcon_wrapper_bd_0/i_sb_arvalid]
connect_bd_net [get_bd_pins intcon_wrapper_bd_0/o_sb_arready] [get_bd_pins swerv_wrapper_verilog_0/sb_axi_arready]
connect_bd_net [get_bd_pins intcon_wrapper_bd_0/o_sb_rid] [get_bd_pins swerv_wrapper_verilog_0/sb_axi_rid]
connect_bd_net [get_bd_pins intcon_wrapper_bd_0/o_sb_rdata] [get_bd_pins swerv_wrapper_verilog_0/sb_axi_rdata]
connect_bd_net [get_bd_pins intcon_wrapper_bd_0/o_sb_rresp] [get_bd_pins swerv_wrapper_verilog_0/sb_axi_rresp]
connect_bd_net [get_bd_pins intcon_wrapper_bd_0/o_sb_rlast] [get_bd_pins swerv_wrapper_verilog_0/sb_axi_rlast]
connect_bd_net [get_bd_pins intcon_wrapper_bd_0/o_sb_rvalid] [get_bd_pins swerv_wrapper_verilog_0/sb_axi_rvalid]
connect_bd_net [get_bd_pins swerv_wrapper_verilog_0/sb_axi_rready] [get_bd_pins intcon_wrapper_bd_0/i_sb_rready]
connect_bd_net [get_bd_pins intcon_wrapper_bd_0/wb_rom_adr_o] [get_bd_pins bootrom_wrapper_0/i_wb_adr]
connect_bd_net [get_bd_pins intcon_wrapper_bd_0/wb_rom_dat_o] [get_bd_pins bootrom_wrapper_0/i_wb_dat]
connect_bd_net [get_bd_pins intcon_wrapper_bd_0/wb_rom_sel_o] [get_bd_pins bootrom_wrapper_0/i_wb_sel]
connect_bd_net [get_bd_pins intcon_wrapper_bd_0/wb_rom_we_o] [get_bd_pins bootrom_wrapper_0/i_wb_we]
connect_bd_net [get_bd_pins intcon_wrapper_bd_0/wb_rom_cyc_o] [get_bd_pins bootrom_wrapper_0/i_wb_cyc]
connect_bd_net [get_bd_pins intcon_wrapper_bd_0/wb_rom_stb_o] [get_bd_pins bootrom_wrapper_0/i_wb_stb]
connect_bd_net [get_bd_pins bootrom_wrapper_0/o_wb_ack] [get_bd_pins intcon_wrapper_bd_0/wb_rom_ack_i]
connect_bd_net [get_bd_pins bootrom_wrapper_0/o_wb_rdt] [get_bd_pins intcon_wrapper_bd_0/wb_rom_dat_i]
connect_bd_net [get_bd_pins intcon_wrapper_bd_0/wb_sys_adr_o] [get_bd_pins syscon_wrapper_0/i_wb_adr]
connect_bd_net [get_bd_pins intcon_wrapper_bd_0/wb_sys_dat_o] [get_bd_pins syscon_wrapper_0/i_wb_dat]
connect_bd_net [get_bd_pins intcon_wrapper_bd_0/wb_sys_sel_o] [get_bd_pins syscon_wrapper_0/i_wb_sel]
connect_bd_net [get_bd_pins intcon_wrapper_bd_0/wb_sys_we_o] [get_bd_pins syscon_wrapper_0/i_wb_we]
connect_bd_net [get_bd_pins intcon_wrapper_bd_0/wb_sys_cyc_o] [get_bd_pins syscon_wrapper_0/i_wb_cyc]
connect_bd_net [get_bd_pins intcon_wrapper_bd_0/wb_sys_stb_o] [get_bd_pins syscon_wrapper_0/i_wb_stb]
connect_bd_net [get_bd_pins gpio_wrapper_0/wb_inta_o] [get_bd_pins syscon_wrapper_0/gpio_irq]
connect_bd_net [get_bd_pins syscon_wrapper_0/o_wb_ack] [get_bd_pins intcon_wrapper_bd_0/wb_sys_ack_i]
connect_bd_net [get_bd_pins syscon_wrapper_0/o_wb_rdt] [get_bd_pins intcon_wrapper_bd_0/wb_sys_dat_i]
connect_bd_net [get_bd_pins syscon_wrapper_0/o_nmi_int] [get_bd_pins swerv_wrapper_verilog_0/nmi_int]
connect_bd_net [get_bd_pins syscon_wrapper_0/o_timer_irq] [get_bd_pins swerv_wrapper_verilog_0/timer_int]
connect_bd_net [get_bd_pins syscon_wrapper_0/o_nmi_vec] [get_bd_pins swerv_wrapper_verilog_0/nmi_vec]
connect_bd_net [get_bd_pins intcon_wrapper_bd_0/wb_gpio_adr_o] [get_bd_pins gpio_wrapper_0/wb_adr_i]
connect_bd_net [get_bd_pins intcon_wrapper_bd_0/wb_gpio_dat_o] [get_bd_pins gpio_wrapper_0/wb_dat_i]
connect_bd_net [get_bd_pins intcon_wrapper_bd_0/wb_gpio_sel_o] [get_bd_pins gpio_wrapper_0/wb_sel_i]
connect_bd_net [get_bd_pins intcon_wrapper_bd_0/wb_gpio_we_o] [get_bd_pins gpio_wrapper_0/wb_we_i]
connect_bd_net [get_bd_pins intcon_wrapper_bd_0/wb_gpio_cyc_o] [get_bd_pins gpio_wrapper_0/wb_cyc_i]
connect_bd_net [get_bd_pins intcon_wrapper_bd_0/wb_gpio_stb_o] [get_bd_pins gpio_wrapper_0/wb_stb_i]
connect_bd_net [get_bd_pins gpio_wrapper_0/wb_dat_o] [get_bd_pins intcon_wrapper_bd_0/wb_gpio_dat_i]
connect_bd_net [get_bd_pins gpio_wrapper_0/wb_ack_o] [get_bd_pins intcon_wrapper_bd_0/wb_gpio_ack_i]
connect_bd_net [get_bd_pins gpio_wrapper_0/wb_err_o] [get_bd_pins intcon_wrapper_bd_0/wb_gpio_err_i]
connect_bd_net [get_bd_pins gpio_wrapper_0/inp_0] [get_bd_pins bidirec_0/inp]
connect_bd_net [get_bd_pins gpio_wrapper_0/oe_0] [get_bd_pins bidirec_0/oe]
connect_bd_net [get_bd_pins bidirec_0/outp] [get_bd_pins gpio_wrapper_0/outp_0]
connect_bd_net [get_bd_pins gpio_wrapper_0/oe_1] [get_bd_pins bidirec_1/oe]
connect_bd_net [get_bd_pins gpio_wrapper_0/oe_2] [get_bd_pins bidirec_2/oe]
connect_bd_net [get_bd_pins gpio_wrapper_0/inp_1] [get_bd_pins bidirec_1/inp]
connect_bd_net [get_bd_pins gpio_wrapper_0/inp_2] [get_bd_pins bidirec_2/inp]
connect_bd_net [get_bd_pins bidirec_1/outp] [get_bd_pins gpio_wrapper_0/outp_1]
connect_bd_net [get_bd_pins bidirec_2/outp] [get_bd_pins gpio_wrapper_0/outp_2]
connect_bd_net [get_bd_pins gpio_wrapper_0/inp_3] [get_bd_pins bidirec_3/inp]
connect_bd_net [get_bd_pins gpio_wrapper_0/inp_4] [get_bd_pins bidirec_4/inp]
connect_bd_net [get_bd_pins gpio_wrapper_0/oe_3] [get_bd_pins bidirec_3/oe]
connect_bd_net [get_bd_pins gpio_wrapper_0/oe_4] [get_bd_pins bidirec_4/oe]
connect_bd_net [get_bd_pins bidirec_3/outp] [get_bd_pins gpio_wrapper_0/outp_3]
connect_bd_net [get_bd_pins bidirec_4/outp] [get_bd_pins gpio_wrapper_0/outp_4]
connect_bd_net [get_bd_pins gpio_wrapper_0/inp_5] [get_bd_pins bidirec_5/inp]
connect_bd_net [get_bd_pins gpio_wrapper_0/oe_5] [get_bd_pins bidirec_5/oe]
connect_bd_net [get_bd_pins gpio_wrapper_0/oe_6] [get_bd_pins bidirec_6/oe]
connect_bd_net [get_bd_pins gpio_wrapper_0/inp_6] [get_bd_pins bidirec_6/inp]
connect_bd_net [get_bd_pins bidirec_5/outp] [get_bd_pins gpio_wrapper_0/outp_5]
connect_bd_net [get_bd_pins bidirec_6/outp] [get_bd_pins gpio_wrapper_0/outp_6]
connect_bd_net [get_bd_pins gpio_wrapper_0/inp_7] [get_bd_pins bidirec_7/inp]
connect_bd_net [get_bd_pins gpio_wrapper_0/oe_7] [get_bd_pins bidirec_7/oe]
connect_bd_net [get_bd_pins bidirec_7/outp] [get_bd_pins gpio_wrapper_0/outp_7]
connect_bd_net [get_bd_pins gpio_wrapper_0/oe_8] [get_bd_pins bidirec_8/oe]
connect_bd_net [get_bd_pins gpio_wrapper_0/inp_8] [get_bd_pins bidirec_8/inp]
connect_bd_net [get_bd_pins bidirec_8/outp] [get_bd_pins gpio_wrapper_0/outp_8]
connect_bd_net [get_bd_pins gpio_wrapper_0/oe_9] [get_bd_pins bidirec_9/oe]
connect_bd_net [get_bd_pins gpio_wrapper_0/inp_9] [get_bd_pins bidirec_9/inp]
connect_bd_net [get_bd_pins bidirec_9/outp] [get_bd_pins gpio_wrapper_0/outp_9]
connect_bd_net [get_bd_pins gpio_wrapper_0/oe_10] [get_bd_pins bidirec_10/oe]
connect_bd_net [get_bd_pins gpio_wrapper_0/inp_10] [get_bd_pins bidirec_10/inp]
connect_bd_net [get_bd_pins bidirec_10/outp] [get_bd_pins gpio_wrapper_0/outp_10]
connect_bd_net [get_bd_pins gpio_wrapper_0/oe_11] [get_bd_pins bidirec_11/oe]
connect_bd_net [get_bd_pins gpio_wrapper_0/inp_11] [get_bd_pins bidirec_11/inp]
connect_bd_net [get_bd_pins bidirec_11/outp] [get_bd_pins gpio_wrapper_0/outp_11]
connect_bd_net [get_bd_pins gpio_wrapper_0/oe_12] [get_bd_pins bidirec_12/oe]
connect_bd_net [get_bd_pins gpio_wrapper_0/inp_12] [get_bd_pins bidirec_12/inp]
connect_bd_net [get_bd_pins bidirec_12/outp] [get_bd_pins gpio_wrapper_0/outp_12]
connect_bd_net [get_bd_pins gpio_wrapper_0/oe_13] [get_bd_pins bidirec_13/oe]
connect_bd_net [get_bd_pins gpio_wrapper_0/inp_13] [get_bd_pins bidirec_13/inp]
connect_bd_net [get_bd_pins bidirec_13/outp] [get_bd_pins gpio_wrapper_0/outp_13]
connect_bd_net [get_bd_pins gpio_wrapper_0/oe_14] [get_bd_pins bidirec_14/oe]
connect_bd_net [get_bd_pins gpio_wrapper_0/inp_14] [get_bd_pins bidirec_14/inp]
connect_bd_net [get_bd_pins bidirec_14/outp] [get_bd_pins gpio_wrapper_0/outp_14]
connect_bd_net [get_bd_pins gpio_wrapper_0/oe_15] [get_bd_pins bidirec_15/oe]
connect_bd_net [get_bd_pins gpio_wrapper_0/inp_15] [get_bd_pins bidirec_15/inp]
connect_bd_net [get_bd_pins bidirec_15/outp] [get_bd_pins gpio_wrapper_0/outp_15]
connect_bd_net [get_bd_pins gpio_wrapper_0/oe_16] [get_bd_pins bidirec_16/oe]
connect_bd_net [get_bd_pins gpio_wrapper_0/inp_16] [get_bd_pins bidirec_16/inp]
connect_bd_net [get_bd_pins bidirec_16/outp] [get_bd_pins gpio_wrapper_0/outp_16]
connect_bd_net [get_bd_pins gpio_wrapper_0/oe_17] [get_bd_pins bidirec_17/oe]
connect_bd_net [get_bd_pins gpio_wrapper_0/inp_17] [get_bd_pins bidirec_17/inp]
connect_bd_net [get_bd_pins bidirec_17/outp] [get_bd_pins gpio_wrapper_0/outp_17]
connect_bd_net [get_bd_pins gpio_wrapper_0/oe_18] [get_bd_pins bidirec_18/oe]
connect_bd_net [get_bd_pins gpio_wrapper_0/inp_18] [get_bd_pins bidirec_18/inp]
connect_bd_net [get_bd_pins bidirec_18/outp] [get_bd_pins gpio_wrapper_0/outp_18]
connect_bd_net [get_bd_pins gpio_wrapper_0/oe_19] [get_bd_pins bidirec_19/oe]
connect_bd_net [get_bd_pins gpio_wrapper_0/inp_19] [get_bd_pins bidirec_19/inp]
connect_bd_net [get_bd_pins bidirec_19/outp] [get_bd_pins gpio_wrapper_0/outp_19]
connect_bd_net [get_bd_pins gpio_wrapper_0/oe_20] [get_bd_pins bidirec_20/oe]
connect_bd_net [get_bd_pins gpio_wrapper_0/inp_20] [get_bd_pins bidirec_20/inp]
connect_bd_net [get_bd_pins bidirec_20/outp] [get_bd_pins gpio_wrapper_0/outp_20]
connect_bd_net [get_bd_pins gpio_wrapper_0/oe_21] [get_bd_pins bidirec_21/oe]
connect_bd_net [get_bd_pins gpio_wrapper_0/inp_21] [get_bd_pins bidirec_21/inp]
connect_bd_net [get_bd_pins bidirec_21/outp] [get_bd_pins gpio_wrapper_0/outp_21]
connect_bd_net [get_bd_pins gpio_wrapper_0/oe_22] [get_bd_pins bidirec_22/oe]
connect_bd_net [get_bd_pins gpio_wrapper_0/inp_22] [get_bd_pins bidirec_22/inp]
connect_bd_net [get_bd_pins bidirec_22/outp] [get_bd_pins gpio_wrapper_0/outp_22]
connect_bd_net [get_bd_pins gpio_wrapper_0/oe_23] [get_bd_pins bidirec_23/oe]
connect_bd_net [get_bd_pins gpio_wrapper_0/inp_23] [get_bd_pins bidirec_23/inp]
connect_bd_net [get_bd_pins bidirec_23/outp] [get_bd_pins gpio_wrapper_0/outp_23]
connect_bd_net [get_bd_pins gpio_wrapper_0/oe_24] [get_bd_pins bidirec_24/oe]
connect_bd_net [get_bd_pins gpio_wrapper_0/inp_24] [get_bd_pins bidirec_24/inp]
connect_bd_net [get_bd_pins bidirec_24/outp] [get_bd_pins gpio_wrapper_0/outp_24]
connect_bd_net [get_bd_pins gpio_wrapper_0/oe_25] [get_bd_pins bidirec_25/oe]
connect_bd_net [get_bd_pins gpio_wrapper_0/inp_25] [get_bd_pins bidirec_25/inp]
connect_bd_net [get_bd_pins bidirec_25/outp] [get_bd_pins gpio_wrapper_0/outp_25]
connect_bd_net [get_bd_pins gpio_wrapper_0/oe_26] [get_bd_pins bidirec_26/oe]
connect_bd_net [get_bd_pins gpio_wrapper_0/inp_26] [get_bd_pins bidirec_26/inp]
connect_bd_net [get_bd_pins bidirec_26/outp] [get_bd_pins gpio_wrapper_0/outp_26]
connect_bd_net [get_bd_pins gpio_wrapper_0/oe_27] [get_bd_pins bidirec_27/oe]
connect_bd_net [get_bd_pins gpio_wrapper_0/inp_27] [get_bd_pins bidirec_27/inp]
connect_bd_net [get_bd_pins bidirec_27/outp] [get_bd_pins gpio_wrapper_0/outp_27]
connect_bd_net [get_bd_pins gpio_wrapper_0/oe_28] [get_bd_pins bidirec_28/oe]
connect_bd_net [get_bd_pins gpio_wrapper_0/inp_28] [get_bd_pins bidirec_28/inp]
connect_bd_net [get_bd_pins bidirec_28/outp] [get_bd_pins gpio_wrapper_0/outp_28]
connect_bd_net [get_bd_pins gpio_wrapper_0/oe_29] [get_bd_pins bidirec_29/oe]
connect_bd_net [get_bd_pins gpio_wrapper_0/inp_29] [get_bd_pins bidirec_29/inp]
connect_bd_net [get_bd_pins bidirec_29/outp] [get_bd_pins gpio_wrapper_0/outp_29]
connect_bd_net [get_bd_pins gpio_wrapper_0/oe_30] [get_bd_pins bidirec_30/oe]
connect_bd_net [get_bd_pins gpio_wrapper_0/inp_30] [get_bd_pins bidirec_30/inp]
connect_bd_net [get_bd_pins bidirec_30/outp] [get_bd_pins gpio_wrapper_0/outp_30]
connect_bd_net [get_bd_pins gpio_wrapper_0/oe_31] [get_bd_pins bidirec_31/oe]
connect_bd_net [get_bd_pins gpio_wrapper_0/inp_31] [get_bd_pins bidirec_31/inp]
connect_bd_net [get_bd_pins bidirec_31/outp] [get_bd_pins gpio_wrapper_0/outp_31]
connect_bd_net -net clk_0_1 [get_bd_ports clk_0] \
  [get_bd_pins swerv_wrapper_verilog_0/clk] [get_bd_pins intcon_wrapper_bd_0/clk_i_wrapper] \
  [get_bd_pins bootrom_wrapper_0/i_clk] [get_bd_pins syscon_wrapper_0/i_clk] [get_bd_pins gpio_wrapper_0/wb_clk_i]
connect_bd_net -net rst_0_1 [get_bd_ports rst_0] \
  [get_bd_pins swerv_wrapper_verilog_0/rst] [get_bd_pins intcon_wrapper_bd_0/rst_ni_wrapper] \
  [get_bd_pins bootrom_wrapper_0/i_rst] [get_bd_pins syscon_wrapper_0/i_rst] [get_bd_pins gpio_wrapper_0/wb_rst_i]
connect_bd_net [get_bd_pins intcon_wrapper_bd_0/o_ram_awid] [get_bd_ports o_ram_awid_0]
connect_bd_net [get_bd_pins intcon_wrapper_bd_0/o_ram_awaddr] [get_bd_ports o_ram_awaddr_0]
connect_bd_net [get_bd_pins intcon_wrapper_bd_0/o_ram_awlen] [get_bd_ports o_ram_awlen_0]
connect_bd_net [get_bd_pins intcon_wrapper_bd_0/o_ram_awsize] [get_bd_ports o_ram_awsize_0]
connect_bd_net [get_bd_pins intcon_wrapper_bd_0/o_ram_awburst] [get_bd_ports o_ram_awburst_0]
connect_bd_net [get_bd_pins intcon_wrapper_bd_0/o_ram_awcache] [get_bd_ports o_ram_awcache_0]
connect_bd_net [get_bd_pins intcon_wrapper_bd_0/o_ram_awprot] [get_bd_ports o_ram_awprot_0]
connect_bd_net [get_bd_pins intcon_wrapper_bd_0/o_ram_awlock] [get_bd_ports o_ram_awlock_0]
connect_bd_net [get_bd_pins intcon_wrapper_bd_0/o_ram_awregion] [get_bd_ports o_ram_awregion_0]
connect_bd_net [get_bd_pins intcon_wrapper_bd_0/o_ram_awqos] [get_bd_ports o_ram_awqos_0]
connect_bd_net [get_bd_pins intcon_wrapper_bd_0/o_ram_awvalid] [get_bd_ports o_ram_awvalid_0]
connect_bd_net [get_bd_pins intcon_wrapper_bd_0/o_ram_arid] [get_bd_ports o_ram_arid_0]
connect_bd_net [get_bd_pins intcon_wrapper_bd_0/o_ram_araddr] [get_bd_ports o_ram_araddr_0]
connect_bd_net [get_bd_pins intcon_wrapper_bd_0/o_ram_arlen] [get_bd_ports o_ram_arlen_0]
connect_bd_net [get_bd_pins intcon_wrapper_bd_0/o_ram_arsize] [get_bd_ports o_ram_arsize_0]
connect_bd_net [get_bd_pins intcon_wrapper_bd_0/o_ram_arburst] [get_bd_ports o_ram_arburst_0]
connect_bd_net [get_bd_pins intcon_wrapper_bd_0/o_ram_arcache] [get_bd_ports o_ram_arcache_0]
connect_bd_net [get_bd_pins intcon_wrapper_bd_0/o_ram_arprot] [get_bd_ports o_ram_arprot_0]
connect_bd_net [get_bd_pins intcon_wrapper_bd_0/o_ram_arlock] [get_bd_ports o_ram_arlock_0]
connect_bd_net [get_bd_pins intcon_wrapper_bd_0/o_ram_arregion] [get_bd_ports o_ram_arregion_0]
connect_bd_net [get_bd_pins intcon_wrapper_bd_0/o_ram_arqos] [get_bd_ports o_ram_arqos_0]
connect_bd_net [get_bd_pins intcon_wrapper_bd_0/o_ram_arvalid] [get_bd_ports o_ram_arvalid_0]
connect_bd_net [get_bd_pins intcon_wrapper_bd_0/o_ram_wdata] [get_bd_ports o_ram_wdata_0]
connect_bd_net [get_bd_pins intcon_wrapper_bd_0/o_ram_wstrb] [get_bd_ports o_ram_wstrb_0]
connect_bd_net [get_bd_pins intcon_wrapper_bd_0/o_ram_wlast] [get_bd_ports o_ram_wlast_0]
connect_bd_net [get_bd_pins intcon_wrapper_bd_0/o_ram_wvalid] [get_bd_ports o_ram_wvalid_0]
connect_bd_net [get_bd_pins intcon_wrapper_bd_0/o_ram_bready] [get_bd_ports o_ram_bready_0]
connect_bd_net [get_bd_pins intcon_wrapper_bd_0/o_ram_rready] [get_bd_ports o_ram_rready_0]
connect_bd_net -net i_ram_arready_0_1 [get_bd_ports i_ram_arready_0] [get_bd_pins intcon_wrapper_bd_0/i_ram_arready]
connect_bd_net -net i_ram_awready_0_1 [get_bd_ports i_ram_awready_0] [get_bd_pins intcon_wrapper_bd_0/i_ram_awready]
connect_bd_net -net i_ram_wready_0_1 [get_bd_ports i_ram_wready_0] [get_bd_pins intcon_wrapper_bd_0/i_ram_wready]
connect_bd_net -net i_ram_bid_0_1 [get_bd_ports i_ram_bid_0] [get_bd_pins intcon_wrapper_bd_0/i_ram_bid]
connect_bd_net -net i_ram_bresp_0_1 [get_bd_ports i_ram_bresp_0] [get_bd_pins intcon_wrapper_bd_0/i_ram_bresp]
connect_bd_net -net i_ram_bvalid_0_1 [get_bd_ports i_ram_bvalid_0] [get_bd_pins intcon_wrapper_bd_0/i_ram_bvalid]
connect_bd_net -net i_ram_rid_0_1 [get_bd_ports i_ram_rid_0] [get_bd_pins intcon_wrapper_bd_0/i_ram_rid]
connect_bd_net -net i_ram_rdata_0_1 [get_bd_ports i_ram_rdata_0] [get_bd_pins intcon_wrapper_bd_0/i_ram_rdata]
connect_bd_net -net i_ram_rresp_0_1 [get_bd_ports i_ram_rresp_0] [get_bd_pins intcon_wrapper_bd_0/i_ram_rresp]
connect_bd_net -net i_ram_rlast_0_1 [get_bd_ports i_ram_rlast_0] [get_bd_pins intcon_wrapper_bd_0/i_ram_rlast]
connect_bd_net -net i_ram_rvalid_0_1 [get_bd_ports i_ram_rvalid_0] [get_bd_pins intcon_wrapper_bd_0/i_ram_rvalid]
connect_bd_net -net dmi_reg_en_0_1 [get_bd_ports dmi_reg_en_0] [get_bd_pins swerv_wrapper_verilog_0/dmi_reg_en]
connect_bd_net -net dmi_reg_addr_0_1 [get_bd_ports dmi_reg_addr_0] [get_bd_pins swerv_wrapper_verilog_0/dmi_reg_addr]
connect_bd_net -net dmi_reg_wr_en_0_1 [get_bd_ports dmi_reg_wr_en_0] [get_bd_pins swerv_wrapper_verilog_0/dmi_reg_wr_en]
connect_bd_net -net dmi_reg_wdata_0_1 [get_bd_ports dmi_reg_wdata_0] [get_bd_pins swerv_wrapper_verilog_0/dmi_reg_wdata]
connect_bd_net -net dmi_hard_reset_0_1 [get_bd_ports dmi_hard_reset_0] [get_bd_pins swerv_wrapper_verilog_0/dmi_hard_reset]
connect_bd_net [get_bd_pins swerv_wrapper_verilog_0/dmi_reg_rdata] [get_bd_ports dmi_reg_rdata_0]
connect_bd_net -net i_ram_init_done_0_1 [get_bd_ports i_ram_init_done_0] [get_bd_pins syscon_wrapper_0/i_ram_init_done]
connect_bd_net -net i_ram_init_error_0_1 [get_bd_ports i_ram_init_error_0] [get_bd_pins syscon_wrapper_0/i_ram_init_error]
connect_bd_net [get_bd_pins syscon_wrapper_0/AN] [get_bd_ports AN_0]
connect_bd_net [get_bd_pins syscon_wrapper_0/Digits_Bits] [get_bd_ports Digits_Bits_0]
connect_bd_net [get_bd_pins bidirec_0/bidir] [get_bd_ports bidir_0]
connect_bd_net [get_bd_pins bidirec_1/bidir] [get_bd_ports bidir_1]
connect_bd_net [get_bd_pins bidirec_2/bidir] [get_bd_ports bidir_2]
connect_bd_net [get_bd_pins bidirec_3/bidir] [get_bd_ports bidir_3]
connect_bd_net [get_bd_pins bidirec_4/bidir] [get_bd_ports bidir_4]
connect_bd_net [get_bd_pins bidirec_5/bidir] [get_bd_ports bidir_5]
connect_bd_net [get_bd_pins bidirec_6/bidir] [get_bd_ports bidir_6]
connect_bd_net [get_bd_pins bidirec_7/bidir] [get_bd_ports bidir_7]
connect_bd_net [get_bd_pins bidirec_8/bidir] [get_bd_ports bidir_8]
connect_bd_net [get_bd_pins bidirec_9/bidir] [get_bd_ports bidir_9]
connect_bd_net [get_bd_pins bidirec_10/bidir] [get_bd_ports bidir_10]
connect_bd_net [get_bd_pins bidirec_11/bidir] [get_bd_ports bidir_11]
connect_bd_net [get_bd_pins bidirec_12/bidir] [get_bd_ports bidir_12]
connect_bd_net [get_bd_pins bidirec_13/bidir] [get_bd_ports bidir_13]
connect_bd_net [get_bd_pins bidirec_14/bidir] [get_bd_ports bidir_14]
connect_bd_net [get_bd_pins bidirec_15/bidir] [get_bd_ports bidir_15]
connect_bd_net [get_bd_pins bidirec_16/bidir] [get_bd_ports bidir_16]
connect_bd_net [get_bd_pins bidirec_17/bidir] [get_bd_ports bidir_17]
connect_bd_net [get_bd_pins bidirec_18/bidir] [get_bd_ports bidir_18]
connect_bd_net [get_bd_pins bidirec_19/bidir] [get_bd_ports bidir_19]
connect_bd_net [get_bd_pins bidirec_20/bidir] [get_bd_ports bidir_20]
connect_bd_net [get_bd_pins bidirec_21/bidir] [get_bd_ports bidir_21]
connect_bd_net [get_bd_pins bidirec_22/bidir] [get_bd_ports bidir_22]
connect_bd_net [get_bd_pins bidirec_23/bidir] [get_bd_ports bidir_23]
connect_bd_net [get_bd_pins bidirec_24/bidir] [get_bd_ports bidir_24]
connect_bd_net [get_bd_pins bidirec_25/bidir] [get_bd_ports bidir_25]
connect_bd_net [get_bd_pins bidirec_26/bidir] [get_bd_ports bidir_26]
connect_bd_net [get_bd_pins bidirec_27/bidir] [get_bd_ports bidir_27]
connect_bd_net [get_bd_pins bidirec_28/bidir] [get_bd_ports bidir_28]
connect_bd_net [get_bd_pins bidirec_29/bidir] [get_bd_ports bidir_29]
connect_bd_net [get_bd_pins bidirec_30/bidir] [get_bd_ports bidir_30]
connect_bd_net [get_bd_pins bidirec_31/bidir] [get_bd_ports bidir_31]

validate_bd_design
save_bd_design
